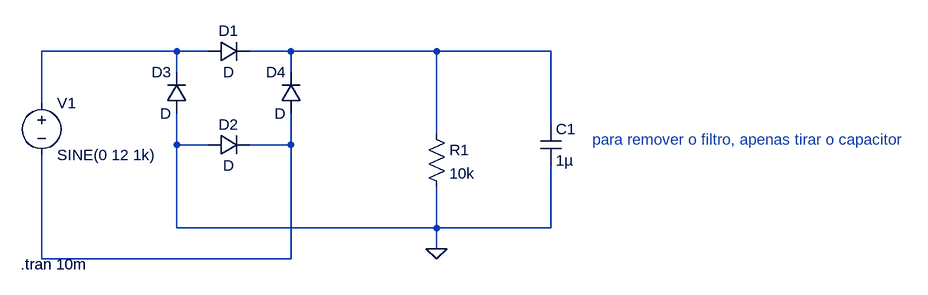
[diagram p0: schematic Retificador de onda completa em ponte.asc]
Retificador de onda completa em ponte.asc, the LTspice schematic file:
Version 4
SHEET 1 1272 680
WIRE 96 96 -112 96
WIRE 144 96 96 96
WIRE 272 96 208 96
WIRE 496 96 272 96
WIRE 672 96 496 96
WIRE 96 128 96 96
WIRE 272 128 272 96
WIRE -112 176 -112 96
WIRE 672 208 672 96
WIRE 496 224 496 96
WIRE 96 240 96 192
WIRE 144 240 96 240
WIRE 272 240 272 192
WIRE 272 240 208 240
WIRE 96 368 96 240
WIRE 496 368 496 304
WIRE 496 368 96 368
WIRE 672 368 672 272
WIRE 672 368 496 368
WIRE 496 400 496 368
WIRE -112 416 -112 256
WIRE 272 416 272 240
WIRE 272 416 -112 416
FLAG 496 400 0
SYMBOL voltage -112 160 R0
WINDOW 123 0 0 Left 0
WINDOW 39 0 0 Left 0
SYMATTR InstName V1
SYMATTR Value SINE(0 12 1k)
SYMBOL diode 144 112 R270
WINDOW 0 32 32 VTop 2
WINDOW 3 0 32 VBottom 2
SYMATTR InstName D1
SYMBOL diode 144 256 R270
WINDOW 0 32 32 VTop 2
WINDOW 3 0 32 VBottom 2
SYMATTR InstName D2
SYMBOL diode 112 192 R180
WINDOW 0 24 64 Left 2
WINDOW 3 24 0 Left 2
SYMATTR InstName D3
SYMBOL diode 288 192 R180
WINDOW 0 24 64 Left 2
WINDOW 3 24 0 Left 2
SYMATTR InstName D4
SYMBOL res 480 208 R0
SYMATTR InstName R1
SYMATTR Value 10k
SYMBOL cap 656 208 R0
SYMATTR InstName C1
SYMATTR Value 1µ
TEXT -144 424 Left 2 !.tran 10m
TEXT 736 232 Left 2 ;para remover o filtro, apenas tirar o capacitor

The netlist it stands for:
* Retificador de onda completa em ponte.asc
V1 N001 N003 SINE(0 12 1k)
D1 N001 N002 D
D2 0 N003 D
D3 0 N001 D
D4 N003 N002 D
R1 N002 0 10k
C1 N002 0 1µ
.model D D
.lib standard.dio
.tran 10m
* para remover o filtro, apenas tirar o capacitor
.backanno
.end